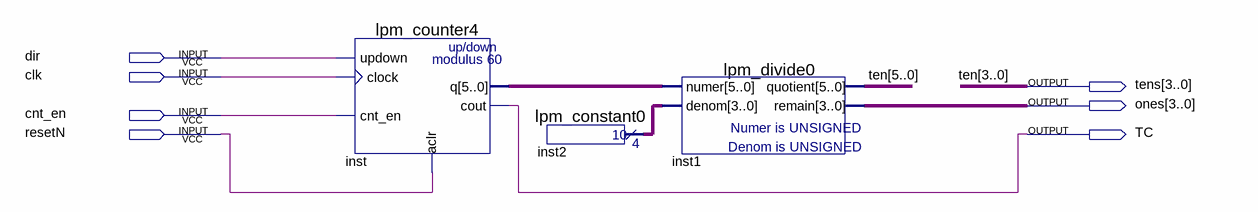
[diagram p0: schematic sheet]
// Quartus schematic BCD_60.bdf as structural Verilog: 3 symbols, 7 pins
module BCD_60 (
  input  dir,
  input  clk,
  input  cnt_en,
  input  resetN,
  output [3:0] tens,
  output [3:0] ones,
  output TC
);

  wire [3:0] inst2_result;
  wire [5:0] inst_q;
  wire [5:4] ten;

  lpm_counter4 inst (.updown(dir), .clock(clk), .cnt_en(cnt_en), .aclr(resetN), .q(inst_q), .cout(TC));
  lpm_constant0 inst2 (.result(inst2_result));
  lpm_divide0 inst1 (.numer(inst_q), .denom(inst2_result), .quotient({ten, tens}), .remain(ones));

  // Other names for the same wires on the sheet: ten[3:0] = tens
endmodule
